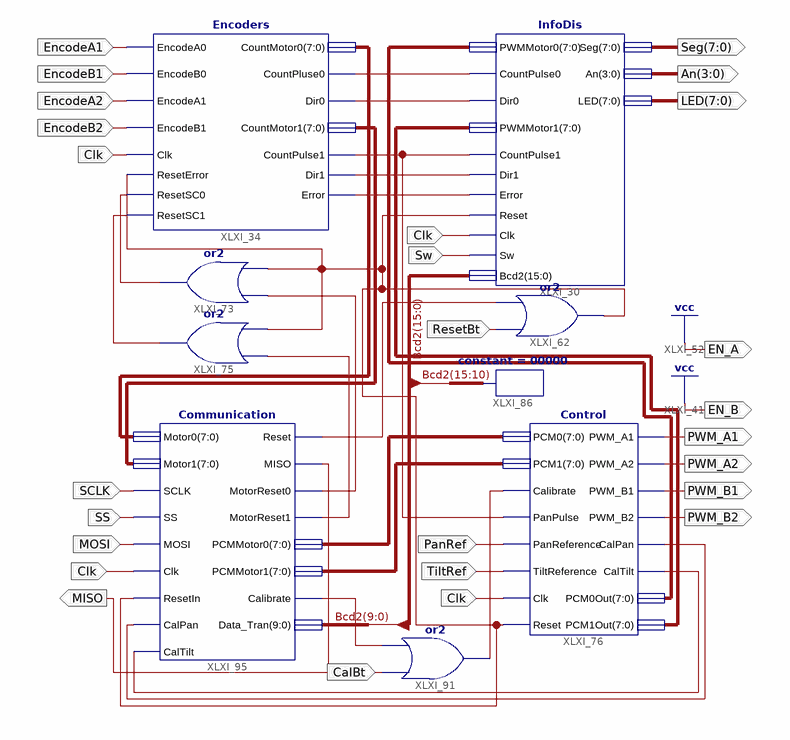
[diagram p0: schematic sheet 1]
// Xilinx ISE schematic Info_test.sch (spartan3e) as structural Verilog: 9 symbols, 23 ports
module Info_test (
  input  Clk,
  input  EncodeB1,
  input  EncodeA2,
  input  EncodeB2,
  input  MOSI,
  input  SS,
  input  SCLK,
  input  PanRef,
  input  TiltRef,
  input  EncodeA1,
  input  ResetBt,
  input  Sw,
  input  CalBt,
  output PWM_A1,
  output PWM_A2,
  output PWM_B1,
  output PWM_B2,
  output [7:0] Seg,
  output [3:0] An,
  output [7:0] LED,
  output EN_B,
  output EN_A,
  output MISO
);

  wire XLXN_336, XLXN_348, XLXN_349, XLXN_525, XLXN_526, XLXN_539, XLXN_607, XLXN_608, XLXN_644, XLXN_656,
       XLXN_658, XLXN_663, XLXN_664, XLXN_667, XLXN_678;
  wire [7:0] XLXN_480, XLXN_481, XLXN_632, XLXN_633, XLXN_634, XLXN_641;
  wire [15:0] Bcd2;

  or XLXI_73 (XLXN_348, XLXN_667, XLXN_663);
  or XLXI_75 (XLXN_349, XLXN_667, XLXN_664);
  Encoders XLXI_34 (
    .CountPluse0(XLXN_526), .Dir0(XLXN_525), .CountMotor0(XLXN_480), .CountMotor1(XLXN_481),
    .CountPulse1(XLXN_644), .Dir1(XLXN_336), .Error(XLXN_539), .EncodeB1(EncodeB2), .EncodeA1(EncodeA2),
    .EncodeA0(EncodeA1), .EncodeB0(EncodeB1), .Clk(Clk), .ResetSC0(XLXN_348), .ResetError(XLXN_667),
    .ResetSC1(XLXN_349));
  InfoDis XLXI_30 (
    .Seg(Seg), .PWMMotor0(XLXN_634), .CountPulse0(XLXN_526), .Dir0(XLXN_525), .An(An), .LED(LED),
    .PWMMotor1(XLXN_641), .CountPulse1(XLXN_644), .Dir1(XLXN_336), .Error(XLXN_539), .Reset(XLXN_667),
    .Bcd2(Bcd2), .Sw(Sw), .Clk(Clk));
  Control XLXI_76 (
    .PCM1(XLXN_633), .PCM0(XLXN_632), .Calibrate(XLXN_678), .Clk(Clk), .PanReference(PanRef),
    .PanPulse(XLXN_644), .TiltReference(TiltRef), .PCM0Out(XLXN_634), .PCM1Out(XLXN_641), .CalTilt(XLXN_607),
    .CalPan(XLXN_608), .PWM_A1(PWM_A1), .PWM_A2(PWM_A2), .PWM_B1(PWM_B1), .PWM_B2(PWM_B2), .Reset(XLXN_667));
  or XLXI_62 (XLXN_667, ResetBt, XLXN_658);
  constant #(.CValue("00000")) XLXI_86 (.O(Bcd2[15:10]));
  Communication XLXI_95 (
    .Clk(Clk), .SCLK(SCLK), .SS(SS), .MOSI(MOSI), .Motor0(XLXN_480), .Motor1(XLXN_481), .CalPan(XLXN_608),
    .CalTilt(XLXN_607), .PCMMotor0(XLXN_632), .PCMMotor1(XLXN_633), .MISO(MISO), .Calibrate(XLXN_656),
    .Data_Tran(Bcd2[9:0]), .MotorReset0(XLXN_663), .MotorReset1(XLXN_664), .Reset(XLXN_658),
    .ResetIn(XLXN_667));
  or XLXI_91 (XLXN_678, CalBt, XLXN_656);

  assign EN_A = 1'b1;
  assign EN_B = 1'b1;
endmodule
